# Altium schematic sheet PowerSplitter.SchDoc
size A
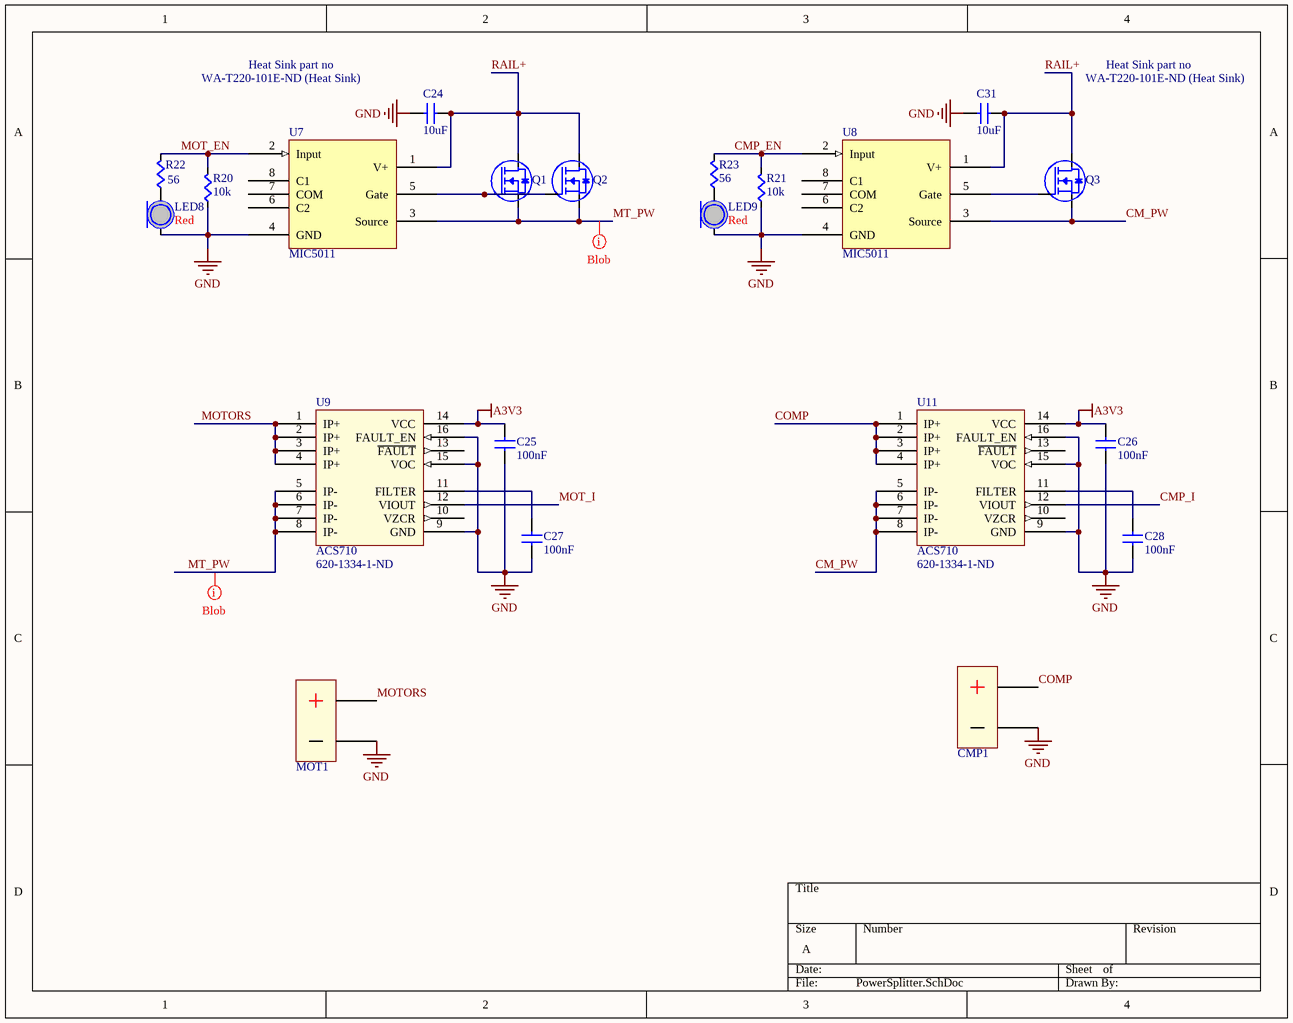
[diagram p0: PowerSplitter.SchDoc]

## Parts
C24  value 10uF  [CAPC1206]  (hidden comment: Cap)
C25  value 100nF  [CAPC0603]  (hidden comment: Cap)
C26  value 100nF  [CAPC0603]  (hidden comment: Cap)
C27  value 100nF  [CAPC0603]  (hidden comment: Cap)
C28  value 100nF  [CAPC0603]  (hidden comment: Cap)
C31  value 10uF  [CAPC1206]  (hidden comment: Cap)
CMP1  BATWIRE  [BATWIRE12]  (value not drawn)
LED8  Color: Red  [LED0805]  (hidden comment: LED)
LED9  Color: Red  [LED0805]  (hidden comment: LED)
MOT1  BATWIRE  [BATWIRE12]  (value not drawn)
Q1  IRFB3306PbF  [TO-220AB Heatsink Vertical]  (value not drawn)
Q2  IRFB3306PbF  [TO-220AB Heatsink Vertical]  (value not drawn)
Q3  IRFB3306PbF  [TO-220AB Heatsink Vertical]  (value not drawn)
R20  value 10k  [RES0603]  (hidden comment: Res)
R21  value 10k  [RES0603]  (hidden comment: Res)
R22  value 56  [RES0603]  (hidden comment: Res)
R23  value 56  [RES0603]  (hidden comment: Res)
U7  MIC5011  [MIC5011]
U8  MIC5011  [MIC5011]
U9  ACS710  Supplier Part Number 1: 620-1334-1-ND  [ACS710]
U11  ACS710  Supplier Part Number 1: 620-1334-1-ND  [ACS710]

## Nets
A3V3: C25.1(A) C26.1(A) U9.14(VCC) U11.14(VCC)
GND: C24.1(A) C25.2(B) C26.2(B) C27.2(B) C28.2(B) C31.1(A) CMP1.- LED8.C LED9.C MOT1.- R20.2(B) R21.2(B) U7.4(GND) U8.4(GND) U9.9(GND) U9.15(VOC) U9.16(FAULT_EN) U11.9(GND) U11.15(VOC) U11.16(FAULT_EN)
CM_PW: Q3.S U8.3(Source) U11.5(IP-) U11.6(IP-) U11.7(IP-) U11.8(IP-)
CMP_EN: R21.1(A) R23.1(A) U8.2(Input)
CMP_I: U11.12(VIOUT)
COMP: CMP1.+ U11.1(IP+) U11.2(IP+) U11.3(IP+) U11.4(IP+)
MOT_EN: R20.1(A) R22.1(A) U7.2(Input)
MOT_I: U9.12(VIOUT)
MOTORS: MOT1.+ U9.1(IP+) U9.2(IP+) U9.3(IP+) U9.4(IP+)
MT_PW: Q1.S Q2.S U7.3(Source) U9.5(IP-) U9.6(IP-) U9.7(IP-) U9.8(IP-)
RAIL+: C24.2(B) C31.2(B) Q1.D Q2.D Q3.D U7.1(V+) U8.1(V+)
NetC27_1: C27.1(A) U9.11(FILTER)
NetC28_1: C28.1(A) U11.11(FILTER)
NetLED8_A: LED8.A R22.2(B)
NetLED9_A: LED9.A R23.2(B)
NetQ1_G: Q1.G Q2.G U7.5(Gate)
NetQ3_G: Q3.G U8.5(Gate)

Not connected (* = marked no-connect by the designer): U7 6(C2) 7(COM) 8(C1); U8 6(C2) 7(COM) 8(C1); U9 10(VZCR) 13(~{FAULT}); U11 10(VZCR) 13(~{FAULT})

## Layout directives
net class Blob: MT_PW

## Notes on the sheet
- WA-T220-101E-ND (Heat Sink)
- Heat Sink part no

## Library data of the parts
CMP1 MOT1 = BATWIRE: Two large gauge leads soldered directly to the board.
Q1-Q3 = IRFx3306PbF: HEXFET Power MOSFET; Heatsink: A10755-ND; Supplier 1: Digi-Key; Supplier Part Number 1: IRFB3306PBF-ND
U7 U8 = MIC5011: Minimum Parts High- or Low-Side MOSFET Driver; Supplier 1: Digi-Key; Supplier Part Number 1: 576-1230-ND
U9 U11 = ACS710: Current Sensor with Integrated Overcurrent Detection; Supplier 1: Digi-Key
C24-C28 C31 = Cap: Supplier 1: Digi-Key
  C24 C31: Supplier Part Number 1: 1276-2876-1-ND
  C25-C28: Supplier Part Number 1: 1276-1000-1-ND
LED8 LED9 = LED: Supplier 1: Digi-Key; Supplier Part Number 1: 754-1133-1-ND
R20-R23 = Res: Supplier 1: Digi-Key
  R20 R21: Supplier Part Number 1: RMCF0603JT10K0CT-ND
  R22 R23: Supplier Part Number 1: RMCF0603JT56R0CT-ND